# Altium project Multivibrator_Circuit.PrjPcb
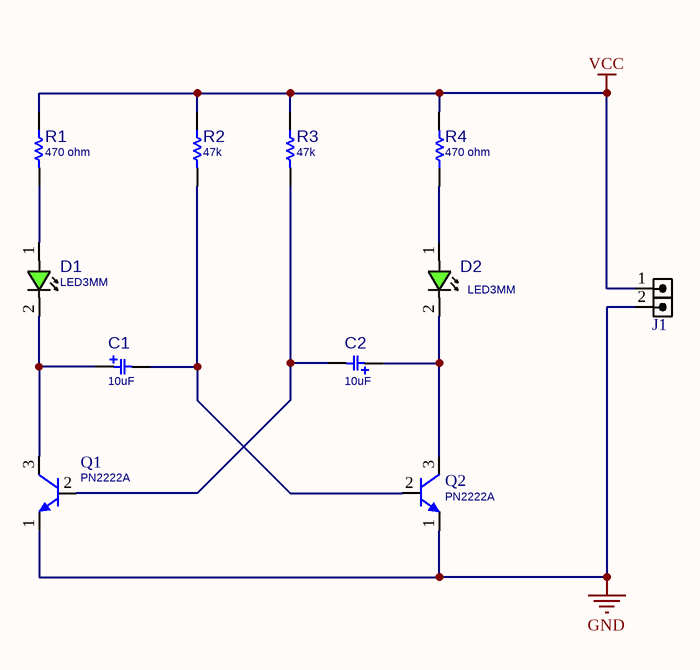
[diagram p0: Sheet2.SchDoc]
1 sheet, 11 parts. Net scope: global (net labels, ports and power ports of the same name join across sheets).
Board files: PCB1.PcbDoc, PCB2_Panel.PcbDoc

## Sheet Sheet2.SchDoc
size A4; SheetNumber: 1; SheetTotal: 1

### Parts
C1  10uF  [C_EL_8X14]
C2  10uF  [C_EL_8X14]
D1  LED3MM  [LED3MM]
D2  LED3MM  [LED3MM]
J1  HDRM2  [HDR_M_1X2]  (value not drawn)
Q1  PN2222A  [TO92_3]
Q2  PN2222A  [TO92_3]
R1  470 ohm  [R025W_AX04]
R2  47k  [R025W_AX04]
R3  47k  [R025W_AX04]
R4  470 ohm  [R025W_AX04]

### Nets
GND: J1.2 Q1.1(E) Q2.1(E)
VCC: J1.1 R1.1 R2.1 R3.1 R4.2
NetC1_1: C1.1 D1.2(CATHODE) Q1.3(C)
NetC1_2: C1.2 Q2.2(B) R2.2
NetC2_1: C2.1 D2.2(CATHODE) Q2.3(C)
NetC2_2: C2.2 Q1.2(B) R3.2
NetD1_1: D1.1(ANODE) R1.2
NetD2_1: D2.1(ANODE) R4.1

### Library data of the parts
C1 C2 = CAP_THD_EL: CAP, THD, ELEC,; MANF_P#: MANF_PART#; PARAM2: 25V; DESC: DESCRIPTION; DIST#: MOUSER; PARAM: 20%; PRICE: 10= 5$; MANF: MANF; ASSEMBLY: ASSEMBLY; VALUE: 10uF
D1 D2 = LED_THD_3MM: LED, THD, 3MM, GREEN; DESC: DESCRIPTION; MANF_P#: MANF_PART#; PARAM2: 2.2V; MANF: MANF; ASSEMBLY: ASSEMBLY; PRICE: PRICE; VALUE: LED3MM
J1 = HDR_M_1X2: CONN, HEADER, Male, pitch: 2.54mm, 2POS; VALUE: HDRM2
Q1 Q2 = NPN_PN2222A_TO92: BJT, NPN, 40v, 0.6A, THD, TO92; PARAM: 0.6A, hFE100~300; PARAM2: 40v, 625mW; MANF: DIOTEC; MANF_P#: PN2222A; VALUE: PN2222A
R1-R4 = RES_THD: RESISTOR, THD; MANF_P#: RK73H1ETTP4701F; MANF: KOA SPEER; PARAM: 0.063W; DESC: DESCRIPTION; DIST#: MOUSER; PARAM2: 1%; ASSEMBLY: ASSEMBLY; PRICE: 100= 0.5$
  R1 R4: VALUE: 470 ohm
  R2 R3: VALUE: 47k